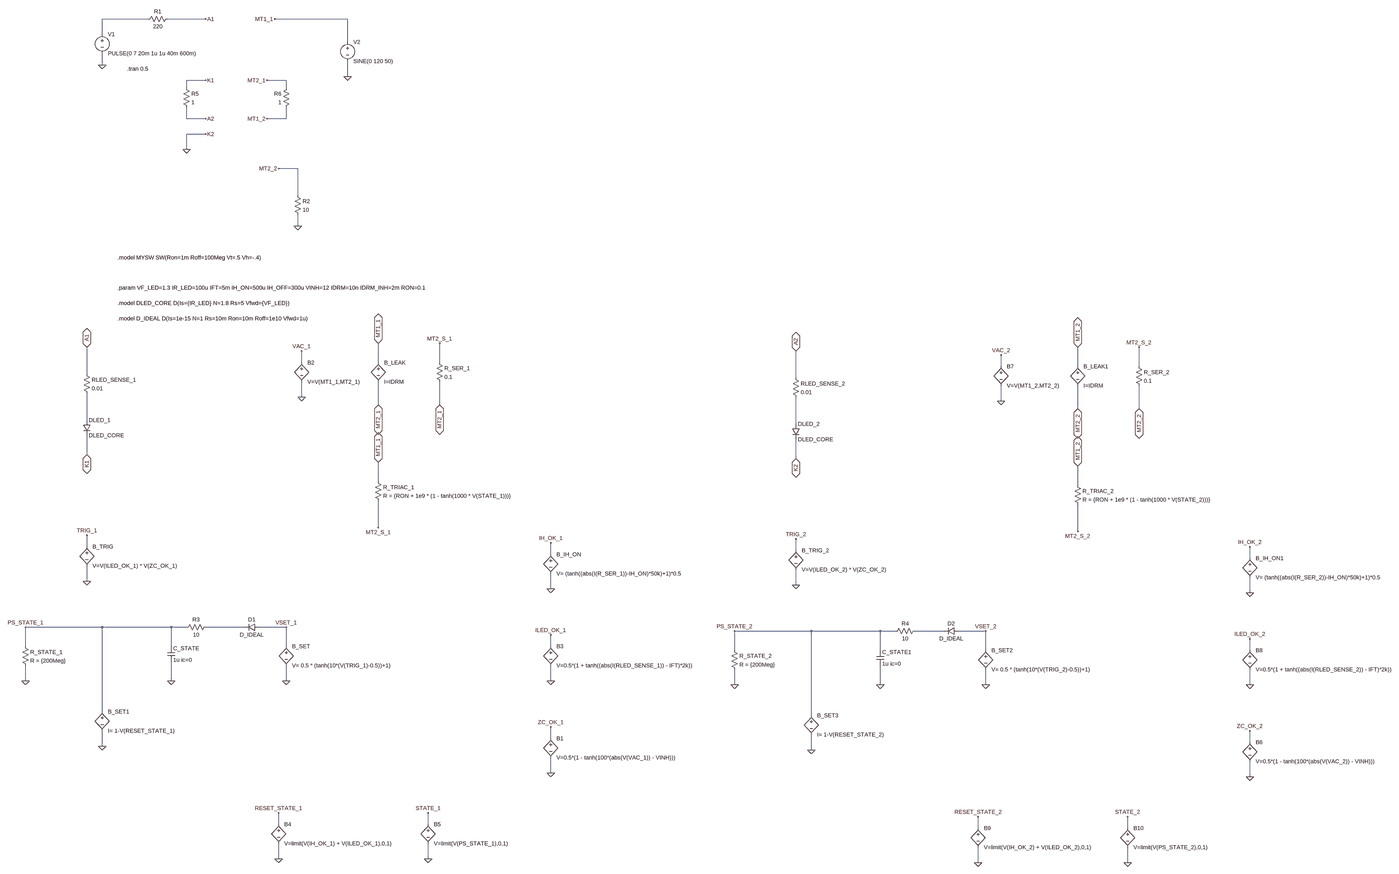
[diagram p0: schematic MOC3083_Dual.asc, whole sheet]
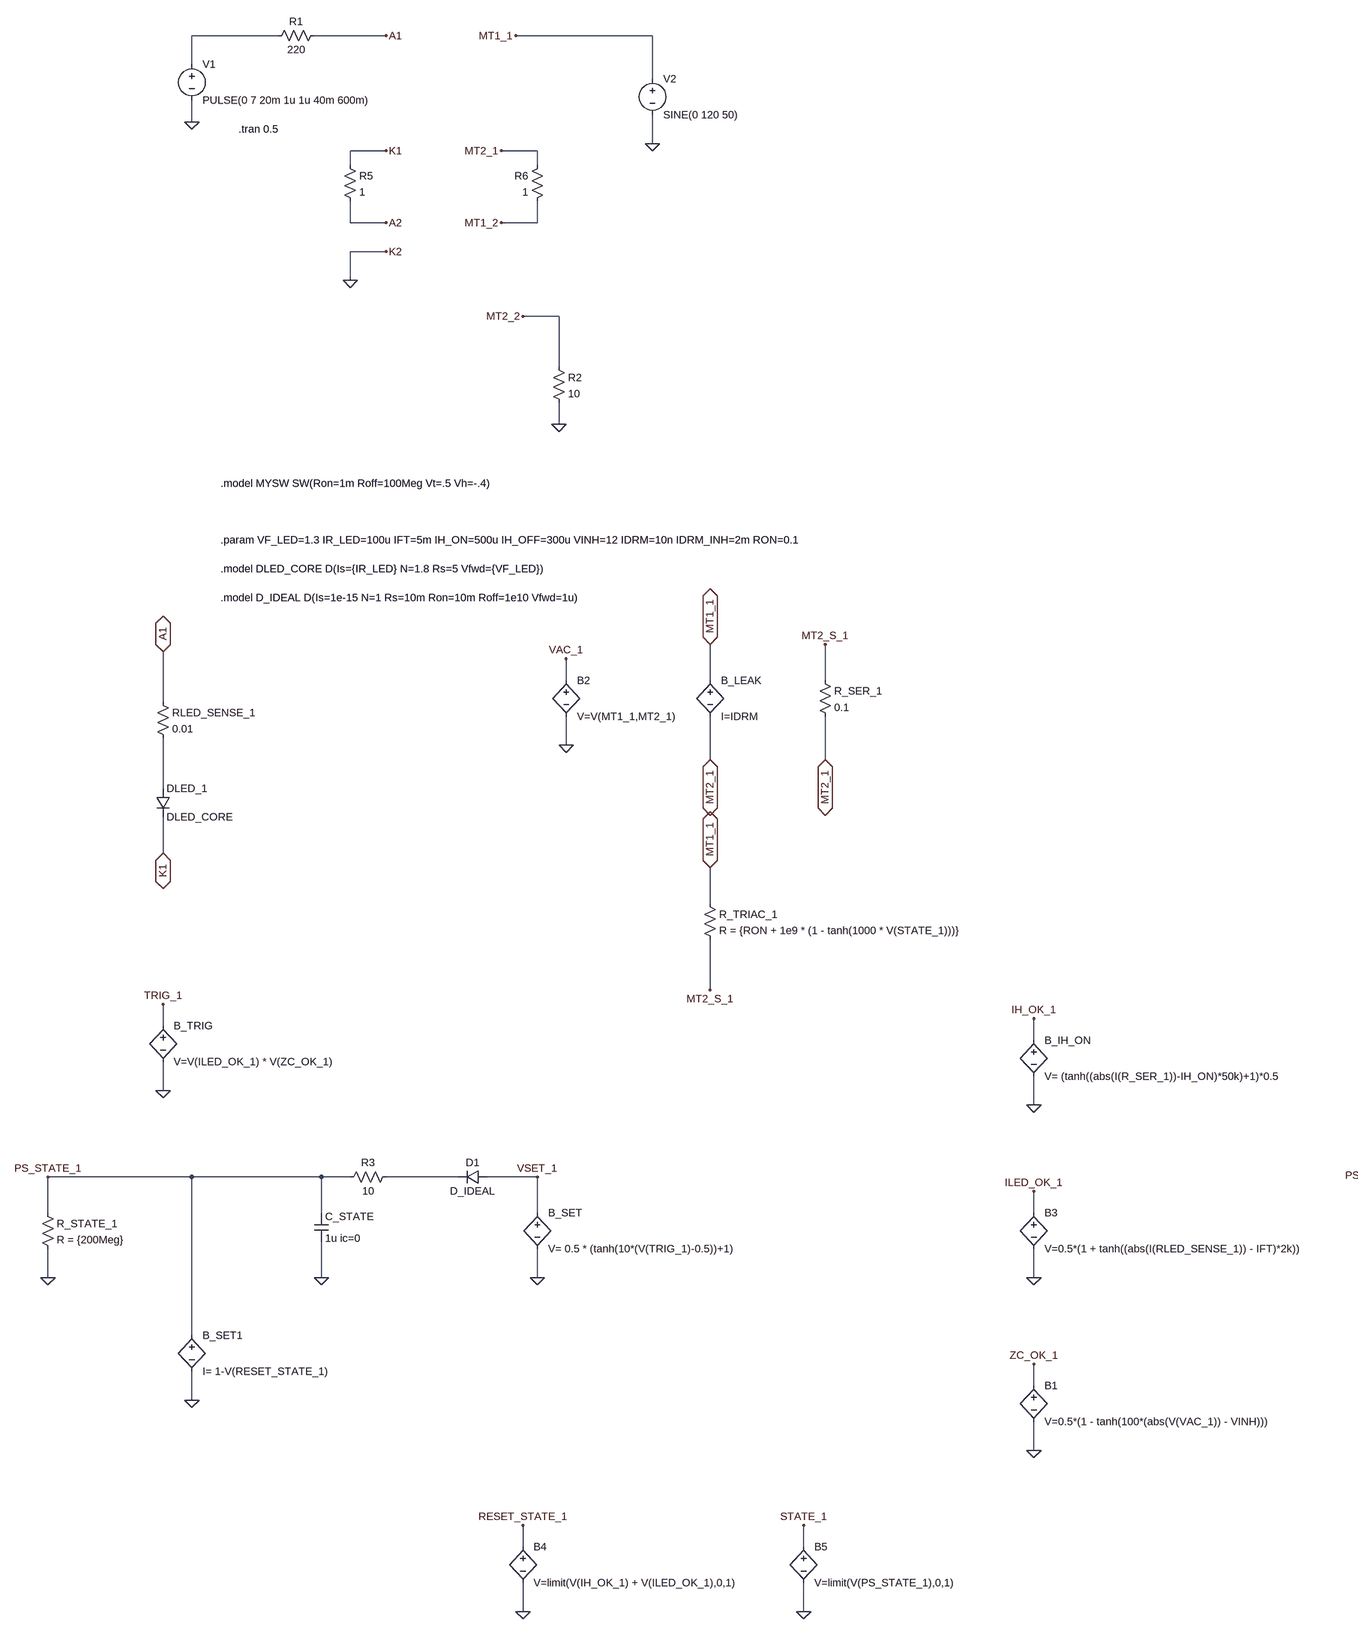
[diagram p1: schematic MOC3083_Dual.asc, part, row 1 of 1, column 1 of 2]
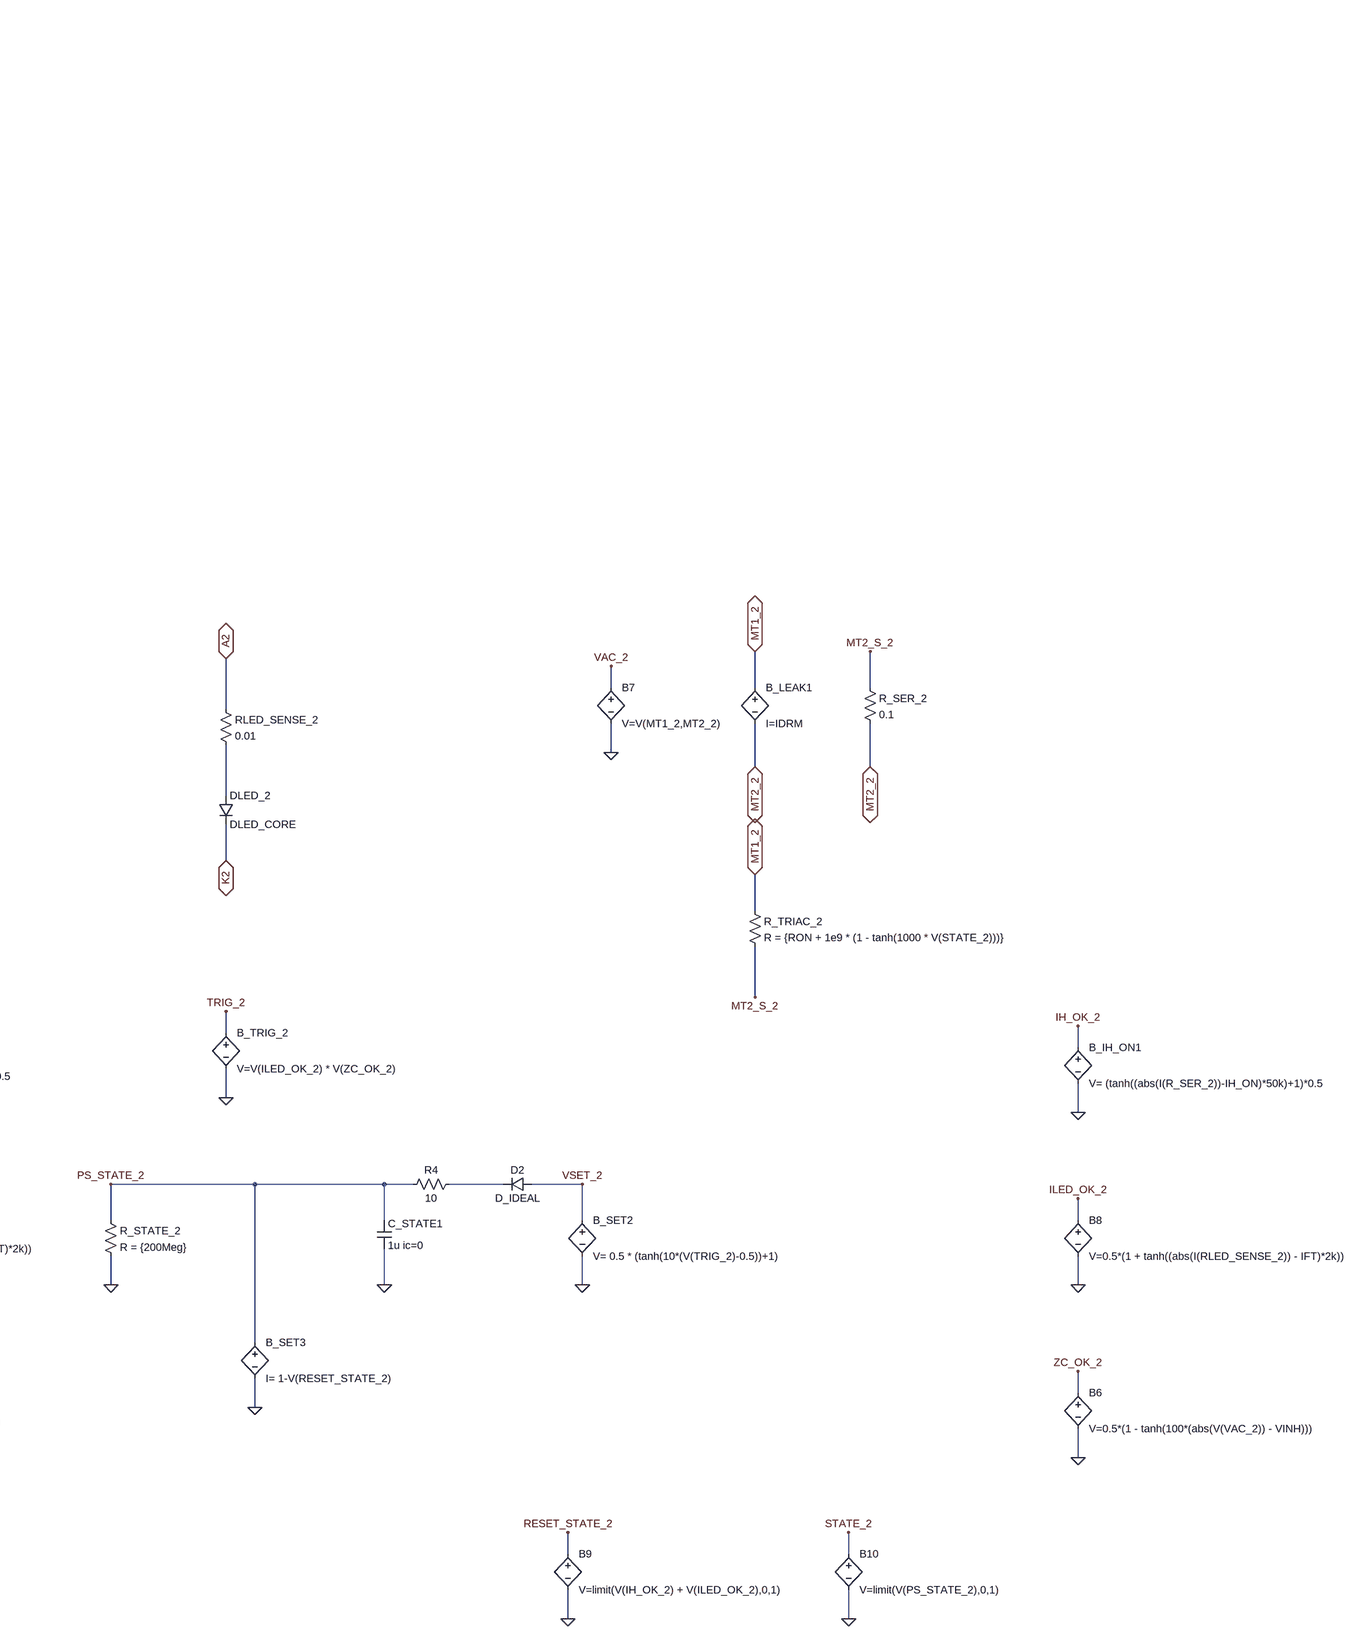
[diagram p2: schematic MOC3083_Dual.asc, part, row 1 of 1, column 2 of 2]
MOC3083_Dual.asc, the LTspice schematic file:
Version 4.1
SHEET 1 5292 3348
WIRE -160 -288 -352 -288
WIRE 80 -288 -80 -288
WIRE 672 -288 368 -288
WIRE -352 -224 -352 -288
WIRE 672 -192 672 -288
WIRE -352 -96 -352 -144
WIRE 672 -48 672 -112
WIRE 80 -32 0 -32
WIRE 416 -32 336 -32
WIRE 0 0 0 -32
WIRE 416 0 416 -32
WIRE 0 128 0 80
WIRE 80 128 0 128
WIRE 416 128 416 80
WIRE 416 128 336 128
WIRE 80 192 0 192
WIRE 0 256 0 192
WIRE 464 336 384 336
WIRE 464 448 464 336
WIRE 464 576 464 528
WIRE 480 1232 480 1184
WIRE 800 1232 800 1152
WIRE 1056 1232 1056 1152
WIRE 3552 1248 3552 1200
WIRE 3872 1248 3872 1168
WIRE 4128 1248 4128 1168
WIRE -416 1280 -416 1168
WIRE 2656 1296 2656 1184
WIRE 480 1376 480 1312
WIRE 3552 1392 3552 1328
WIRE 800 1408 800 1312
WIRE 1056 1408 1056 1312
WIRE 3872 1424 3872 1328
WIRE 4128 1424 4128 1328
WIRE -416 1472 -416 1360
WIRE 2656 1488 2656 1376
WIRE -416 1616 -416 1536
WIRE 2656 1632 2656 1552
WIRE 800 1728 800 1648
WIRE 3872 1744 3872 1664
WIRE 800 1920 800 1808
WIRE 3872 1936 3872 1824
WIRE -416 2000 -416 1952
WIRE 2656 2016 2656 1968
WIRE 1568 2032 1568 1984
WIRE 4640 2048 4640 2000
WIRE -416 2144 -416 2080
WIRE 2656 2160 2656 2096
WIRE 1568 2176 1568 2112
WIRE 4640 2192 4640 2128
WIRE -352 2336 -672 2336
WIRE -64 2336 -352 2336
WIRE 0 2336 -64 2336
WIRE 240 2336 80 2336
WIRE 416 2336 304 2336
WIRE 2720 2352 2400 2352
WIRE 3008 2352 2720 2352
WIRE 3072 2352 3008 2352
WIRE 3312 2352 3152 2352
WIRE 3488 2352 3376 2352
WIRE -672 2416 -672 2336
WIRE -64 2416 -64 2336
WIRE 416 2416 416 2336
WIRE 1568 2416 1568 2368
WIRE 2400 2432 2400 2352
WIRE 3008 2432 3008 2352
WIRE 3488 2432 3488 2352
WIRE 4640 2432 4640 2384
WIRE -672 2560 -672 2496
WIRE -64 2560 -64 2480
WIRE 416 2560 416 2496
WIRE 1568 2560 1568 2496
WIRE 2400 2576 2400 2512
WIRE 3008 2576 3008 2496
WIRE 3488 2576 3488 2512
WIRE 4640 2576 4640 2512
WIRE -352 2688 -352 2336
WIRE 2720 2704 2720 2352
WIRE 1568 2800 1568 2752
WIRE 4640 2816 4640 2768
WIRE -352 2832 -352 2768
WIRE 2720 2848 2720 2784
WIRE 1568 2944 1568 2880
WIRE 4640 2960 4640 2896
WIRE 384 3168 384 3120
WIRE 1008 3168 1008 3120
WIRE 3456 3184 3456 3136
WIRE 4080 3184 4080 3136
WIRE 384 3312 384 3248
WIRE 1008 3312 1008 3248
WIRE 3456 3328 3456 3264
WIRE 4080 3328 4080 3264
FLAG 0 256 0
FLAG -352 -96 0
FLAG 464 576 0
FLAG 672 -48 0
FLAG 80 -288 A1
FLAG 80 192 K2
FLAG 368 -288 MT1_1
FLAG 384 336 MT2_2
FLAG -416 1168 A1
IOPIN -416 1168 BiDir
FLAG -416 1616 K1
IOPIN -416 1616 BiDir
FLAG 800 1408 MT2_1
IOPIN 800 1408 BiDir
FLAG 800 1152 MT1_1
IOPIN 800 1152 BiDir
FLAG 1568 2944 0
FLAG 1568 2752 ZC_OK_1
FLAG 480 1376 0
FLAG 480 1184 VAC_1
FLAG -416 2144 0
FLAG -416 1952 TRIG_1
FLAG -672 2560 0
FLAG -64 2560 0
FLAG -672 2336 PS_STATE_1
FLAG 416 2560 0
FLAG 1568 2176 0
FLAG 1568 1984 IH_OK_1
FLAG 1056 1408 MT2_1
IOPIN 1056 1408 BiDir
FLAG 1056 1152 MT2_S_1
FLAG 800 1648 MT1_1
IOPIN 800 1648 BiDir
FLAG 800 1920 MT2_S_1
FLAG 1568 2368 ILED_OK_1
FLAG 384 3312 0
FLAG 384 3120 RESET_STATE_1
FLAG 416 2336 VSET_1
FLAG 1568 2560 0
FLAG -352 2832 0
FLAG 1008 3312 0
FLAG 1008 3120 STATE_1
FLAG 2656 1184 A2
IOPIN 2656 1184 BiDir
FLAG 2656 1632 K2
IOPIN 2656 1632 BiDir
FLAG 3872 1424 MT2_2
IOPIN 3872 1424 BiDir
FLAG 3872 1168 MT1_2
IOPIN 3872 1168 BiDir
FLAG 4640 2960 0
FLAG 4640 2768 ZC_OK_2
FLAG 3552 1392 0
FLAG 3552 1200 VAC_2
FLAG 2656 2160 0
FLAG 2656 1968 TRIG_2
FLAG 2400 2576 0
FLAG 3008 2576 0
FLAG 2400 2352 PS_STATE_2
FLAG 3488 2576 0
FLAG 4640 2192 0
FLAG 4640 2000 IH_OK_2
FLAG 4128 1424 MT2_2
IOPIN 4128 1424 BiDir
FLAG 4128 1168 MT2_S_2
FLAG 3872 1664 MT1_2
IOPIN 3872 1664 BiDir
FLAG 3872 1936 MT2_S_2
FLAG 4640 2384 ILED_OK_2
FLAG 3456 3328 0
FLAG 3456 3136 RESET_STATE_2
FLAG 3488 2352 VSET_2
FLAG 4640 2576 0
FLAG 2720 2848 0
FLAG 4080 3328 0
FLAG 4080 3136 STATE_2
FLAG 80 -32 K1
FLAG 80 128 A2
FLAG 336 -32 MT2_1
FLAG 336 128 MT1_2
SYMBOL res -64 -304 R90
WINDOW 0 0 56 VBottom 2
WINDOW 3 32 56 VTop 2
SYMATTR InstName R1
SYMATTR Value 220
SYMBOL voltage -352 -240 R0
WINDOW 123 0 0 Left 0
WINDOW 39 0 0 Left 0
SYMATTR InstName V1
SYMATTR Value PULSE(0 7 20m 1u 1u 40m 600m)
SYMBOL res 448 432 R0
SYMATTR InstName R2
SYMATTR Value 10
SYMBOL voltage 672 -208 R0
WINDOW 123 0 0 Left 0
WINDOW 39 0 0 Left 0
SYMATTR InstName V2
SYMATTR Value SINE(0 120 50)
SYMBOL diode -432 1472 R0
SYMATTR InstName DLED_1
SYMATTR Value DLED_CORE
SYMBOL bv 1568 2784 R0
SYMATTR InstName B1
SYMATTR Value V=0.5*(1 - tanh(100*(abs(V(VAC_1)) - VINH)))
SYMBOL res -432 1264 R0
SYMATTR InstName RLED_SENSE_1
SYMATTR Value 0.01
SYMBOL bv 480 1216 R0
SYMATTR InstName B2
SYMATTR Value V=V(MT1_1,MT2_1)
SYMBOL bv -416 1984 R0
SYMATTR InstName B_TRIG
SYMATTR Value V=V(ILED_OK_1) * V(ZC_OK_1)
SYMBOL res -688 2400 R0
SYMATTR InstName R_STATE_1
SYMATTR Value R = {200Meg}
SYMBOL cap -80 2416 R0
SYMATTR InstName C_STATE
SYMATTR Value 1u ic=0
SYMBOL bv 416 2400 R0
SYMATTR InstName B_SET
SYMATTR Value V= 0.5 * (tanh(10*(V(TRIG_1)-0.5))+1)
SYMBOL bv 1568 2016 R0
SYMATTR InstName B_IH_ON
SYMATTR Value V= (tanh((abs(I(R_SER_1))-IH_ON)*50k)+1)*0.5
SYMBOL res 1040 1216 R0
SYMATTR InstName R_SER_1
SYMATTR Value 0.1
SYMBOL res 784 1712 R0
SYMATTR InstName R_TRIAC_1
SYMATTR Value R = {RON + 1e9 * (1 - tanh(1000 * V(STATE_1)))}
SYMBOL bv 800 1216 R0
SYMATTR InstName B_LEAK
SYMATTR Value I=IDRM
SYMBOL res 96 2320 R90
WINDOW 0 0 56 VBottom 2
WINDOW 3 32 56 VTop 2
SYMATTR InstName R3
SYMATTR Value 10
SYMBOL diode 304 2320 R90
WINDOW 0 0 32 VBottom 2
WINDOW 3 32 32 VTop 2
SYMATTR InstName D1
SYMATTR Value D_IDEAL
SYMBOL bv 1568 2400 R0
SYMATTR InstName B3
SYMATTR Value V=0.5*(1 + tanh((abs(I(RLED_SENSE_1)) - IFT)*2k))
SYMBOL bv 384 3152 R0
SYMATTR InstName B4
SYMATTR Value V=limit(V(IH_OK_1) + V(ILED_OK_1),0,1)
SYMBOL bv -352 2672 R0
SYMATTR InstName B_SET1
SYMATTR Value I= 1-V(RESET_STATE_1)
SYMBOL bv 1008 3152 R0
SYMATTR InstName B5
SYMATTR Value V=limit(V(PS_STATE_1),0,1)
SYMBOL diode 2640 1488 R0
SYMATTR InstName DLED_2
SYMATTR Value DLED_CORE
SYMBOL bv 4640 2800 R0
SYMATTR InstName B6
SYMATTR Value V=0.5*(1 - tanh(100*(abs(V(VAC_2)) - VINH)))
SYMBOL res 2640 1280 R0
SYMATTR InstName RLED_SENSE_2
SYMATTR Value 0.01
SYMBOL bv 3552 1232 R0
SYMATTR InstName B7
SYMATTR Value V=V(MT1_2,MT2_2)
SYMBOL bv 2656 2000 R0
SYMATTR InstName B_TRIG_2
SYMATTR Value V=V(ILED_OK_2) * V(ZC_OK_2)
SYMBOL res 2384 2416 R0
SYMATTR InstName R_STATE_2
SYMATTR Value R = {200Meg}
SYMBOL cap 2992 2432 R0
SYMATTR InstName C_STATE1
SYMATTR Value 1u ic=0
SYMBOL bv 3488 2416 R0
SYMATTR InstName B_SET2
SYMATTR Value V= 0.5 * (tanh(10*(V(TRIG_2)-0.5))+1)
SYMBOL bv 4640 2032 R0
SYMATTR InstName B_IH_ON1
SYMATTR Value V= (tanh((abs(I(R_SER_2))-IH_ON)*50k)+1)*0.5
SYMBOL res 4112 1232 R0
SYMATTR InstName R_SER_2
SYMATTR Value 0.1
SYMBOL res 3856 1728 R0
SYMATTR InstName R_TRIAC_2
SYMATTR Value R = {RON + 1e9 * (1 - tanh(1000 * V(STATE_2)))}
SYMBOL bv 3872 1232 R0
SYMATTR InstName B_LEAK1
SYMATTR Value I=IDRM
SYMBOL res 3168 2336 R90
WINDOW 0 0 56 VBottom 2
WINDOW 3 32 56 VTop 2
SYMATTR InstName R4
SYMATTR Value 10
SYMBOL diode 3376 2336 R90
WINDOW 0 0 32 VBottom 2
WINDOW 3 32 32 VTop 2
SYMATTR InstName D2
SYMATTR Value D_IDEAL
SYMBOL bv 4640 2416 R0
SYMATTR InstName B8
SYMATTR Value V=0.5*(1 + tanh((abs(I(RLED_SENSE_2)) - IFT)*2k))
SYMBOL bv 3456 3168 R0
SYMATTR InstName B9
SYMATTR Value V=limit(V(IH_OK_2) + V(ILED_OK_2),0,1)
SYMBOL bv 2720 2688 R0
SYMATTR InstName B_SET3
SYMATTR Value I= 1-V(RESET_STATE_2)
SYMBOL bv 4080 3168 R0
SYMATTR InstName B10
SYMATTR Value V=limit(V(PS_STATE_2),0,1)
SYMBOL res -16 -16 R0
SYMATTR InstName R5
SYMATTR Value 1
SYMBOL res 432 -16 M0
SYMATTR InstName R6
SYMATTR Value 1
TEXT -248 -80 Left 2 !.tran 0.5
TEXT -288 920 Left 2 !.param VF_LED=1.3 IR_LED=100u IFT=5m IH_ON=500u IH_OFF=300u VINH=12 IDRM=10n IDRM_INH=2m RON=0.1
TEXT -288 984 Left 2 !.model DLED_CORE D(Is={IR_LED} N=1.8 Rs=5 Vfwd={VF_LED})
TEXT -288 1048 Left 2 !.model D_IDEAL D(Is=1e-15 N=1 Rs=10m Ron=10m Roff=1e10 Vfwd=1u)
TEXT -288 752 Left 2 !.model MYSW SW(Ron=1m Roff=100Meg Vt=.5 Vh=-.4)

The netlist it stands for:
* MOC3083_Dual.asc
R1 A1 N001 220
V1 N001 0 PULSE(0 7 20m 1u 1u 40m 600m)
R2 MT2_2 0 10
V2 MT1_1 0 SINE(0 120 50)
DLED_1 N002 K1 DLED_CORE
B1 ZC_OK_1 0 V=0.5*(1 - tanh(100*(abs(V(VAC_1)) - VINH)))
RLED_SENSE_1 A1 N002 0.01
B2 VAC_1 0 V=V(MT1_1,MT2_1)
B_TRIG TRIG_1 0 V=V(ILED_OK_1) * V(ZC_OK_1)
R_STATE_1 PS_STATE_1 0 R = {200Meg}
C_STATE PS_STATE_1 0 1u ic=0
B_SET VSET_1 0 V= 0.5 * (tanh(10*(V(TRIG_1)-0.5))+1)
B_IH_ON IH_OK_1 0 V= (tanh((abs(I(R_SER_1))-IH_ON)*50k)+1)*0.5
R_SER_1 MT2_S_1 MT2_1 0.1
R_TRIAC_1 MT1_1 MT2_S_1 R = {RON + 1e9 * (1 - tanh(1000 * V(STATE_1)))}
B_LEAK MT1_1 MT2_1 I=IDRM
R3 N004 PS_STATE_1 10
D1 VSET_1 N004 D_IDEAL
B3 ILED_OK_1 0 V=0.5*(1 + tanh((abs(I(RLED_SENSE_1)) - IFT)*2k))
B4 RESET_STATE_1 0 V=limit(V(IH_OK_1) + V(ILED_OK_1),0,1)
B_SET1 PS_STATE_1 0 I= 1-V(RESET_STATE_1)
B5 STATE_1 0 V=limit(V(PS_STATE_1),0,1)
DLED_2 N003 0 DLED_CORE
B6 ZC_OK_2 0 V=0.5*(1 - tanh(100*(abs(V(VAC_2)) - VINH)))
RLED_SENSE_2 A2 N003 0.01
B7 VAC_2 0 V=V(MT1_2,MT2_2)
B_TRIG_2 TRIG_2 0 V=V(ILED_OK_2) * V(ZC_OK_2)
R_STATE_2 PS_STATE_2 0 R = {200Meg}
C_STATE1 PS_STATE_2 0 1u ic=0
B_SET2 VSET_2 0 V= 0.5 * (tanh(10*(V(TRIG_2)-0.5))+1)
B_IH_ON1 IH_OK_2 0 V= (tanh((abs(I(R_SER_2))-IH_ON)*50k)+1)*0.5
R_SER_2 MT2_S_2 MT2_2 0.1
R_TRIAC_2 MT1_2 MT2_S_2 R = {RON + 1e9 * (1 - tanh(1000 * V(STATE_2)))}
B_LEAK1 MT1_2 MT2_2 I=IDRM
R4 N005 PS_STATE_2 10
D2 VSET_2 N005 D_IDEAL
B8 ILED_OK_2 0 V=0.5*(1 + tanh((abs(I(RLED_SENSE_2)) - IFT)*2k))
B9 RESET_STATE_2 0 V=limit(V(IH_OK_2) + V(ILED_OK_2),0,1)
B_SET3 PS_STATE_2 0 I= 1-V(RESET_STATE_2)
B10 STATE_2 0 V=limit(V(PS_STATE_2),0,1)
R5 K1 A2 1
R6 MT2_1 MT1_2 1
.model D D
.lib standard.dio
.tran 0.5
.param VF_LED=1.3 IR_LED=100u IFT=5m IH_ON=500u IH_OFF=300u VINH=12 IDRM=10n IDRM_INH=2m RON=0.1
.model DLED_CORE D(Is={IR_LED} N=1.8 Rs=5 Vfwd={VF_LED})
.model D_IDEAL D(Is=1e-15 N=1 Rs=10m Ron=10m Roff=1e10 Vfwd=1u)
.model MYSW SW(Ron=1m Roff=100Meg Vt=.5 Vh=-.4)
.backanno
.end